# EAGLE design dac-shield (EAGLE 6.6.0)
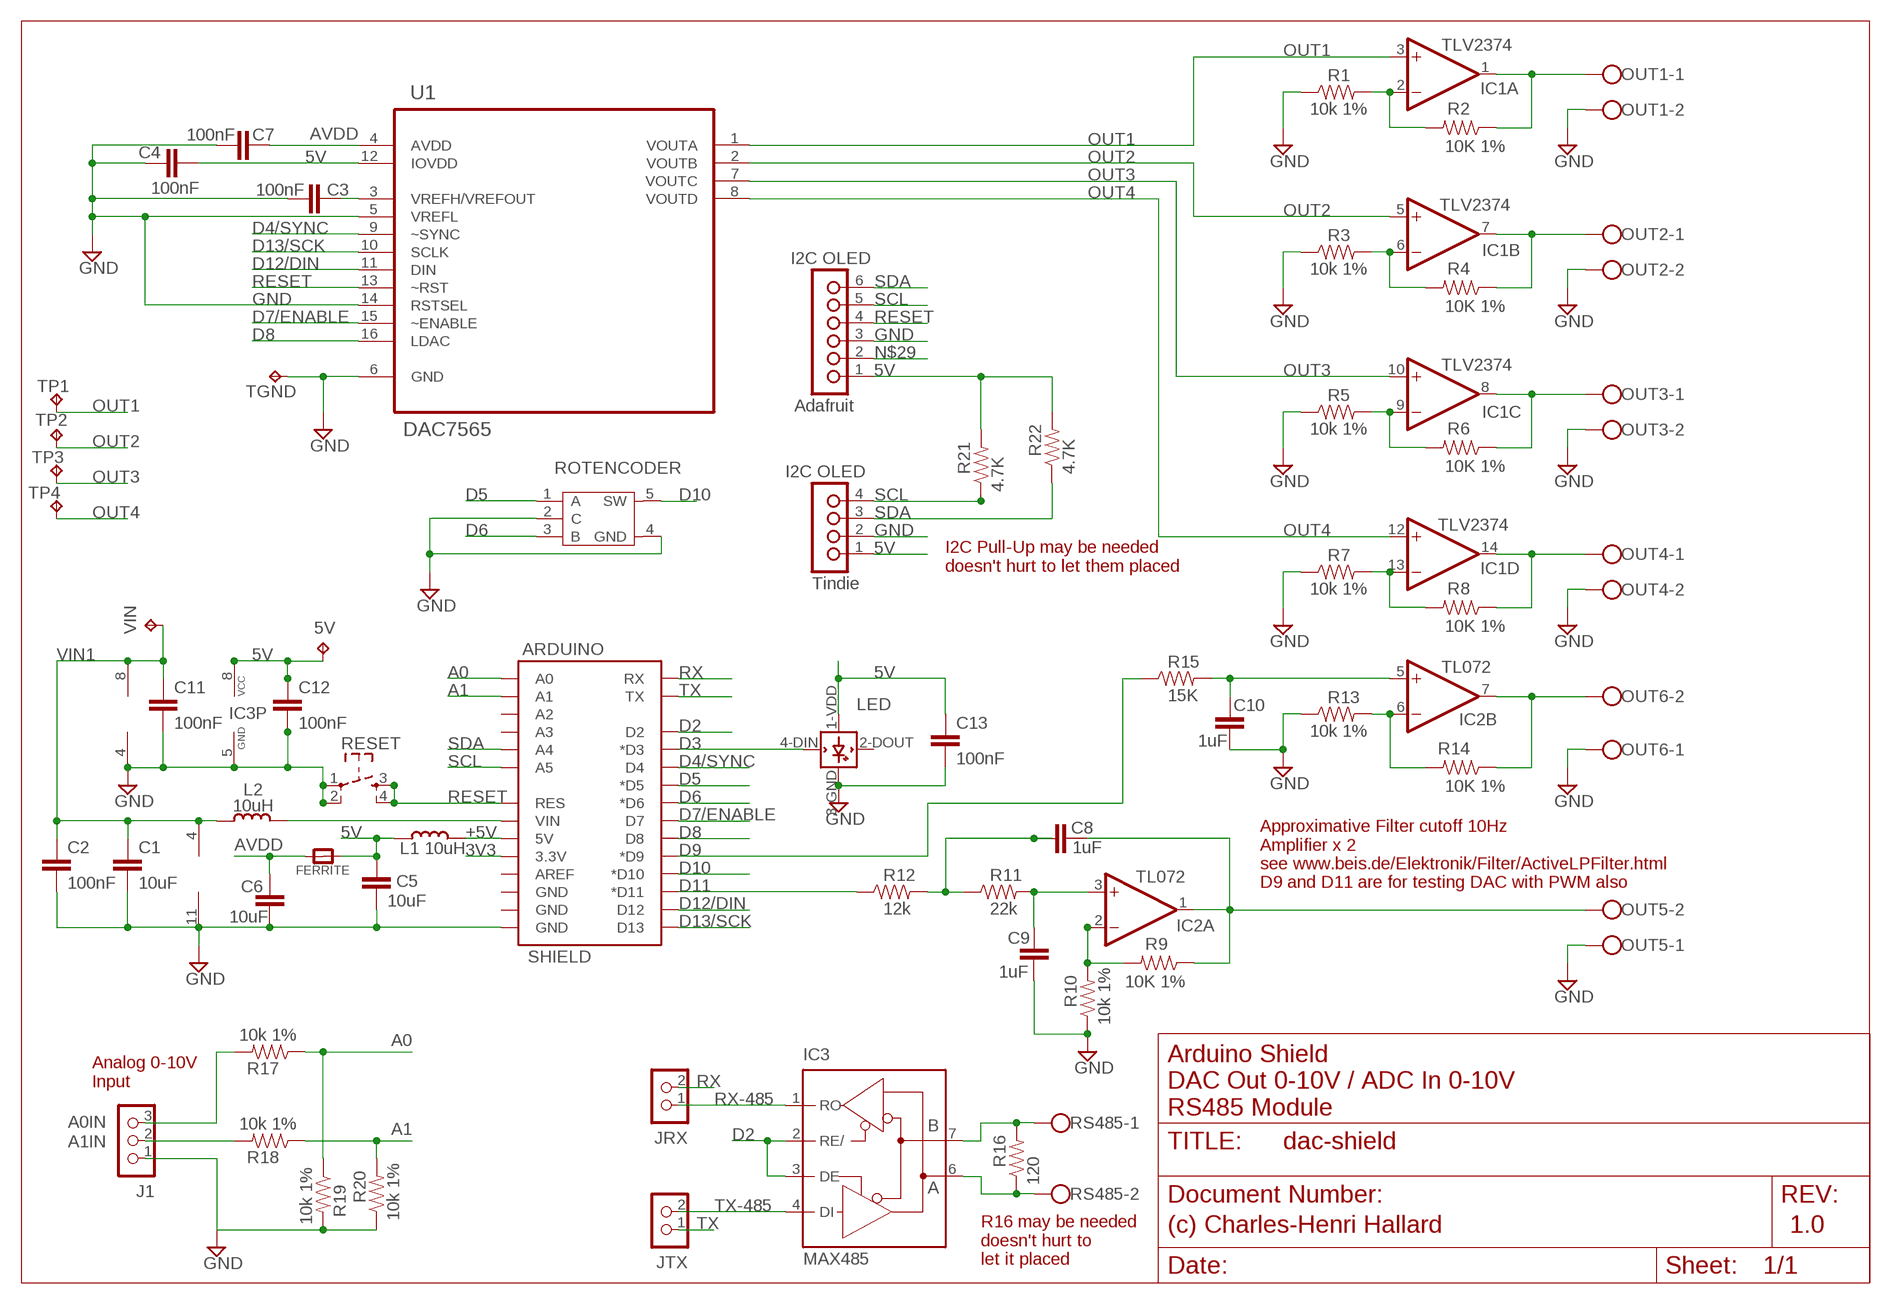
[diagram p0: schematic, sheet 1]

## Parts
5V  TPPAD1-13  [P1-13]
ARDUINO  SHIELD  ARDUINO_SHIELDNOHOLES  [DUEMILANOVE_SHIELD_NOHOLES]
C1  10uF  CAP0805-CAP  [0805-CAP]
C2  100nF  CAP0805-CAP  [0805-CAP]
C3  100nF  CAP0805-CAP  [0805-CAP]
C4  100nF  CAP0805-CAP  [0805-CAP]
C5  10uF  CAP0805-CAP  [0805-CAP]
C6  10uF  CAP0805-CAP  [0805-CAP]
C7  100nF  CAP0805-CAP  [0805-CAP]
C8  1uF  CAP0805-CAP  [0805-CAP]
C9  1uF  CAP0805-CAP  [0805-CAP]
C10  1uF  CAP0805-CAP  [0805-CAP]
C11  100nF  CAP0805-CAP  [0805-CAP]
C12  100nF  CAP0805-CAP  [0805-CAP]
C13  100nF  CAP0805-CAP  [0805-CAP]
FERRITE  FERRITE_0603  [_0603]
IC1  TLV2374  LM324D  [SO14]
IC2  TL072  TL072D  [SO08]
IC3  MAX485  MAX481CSA  [SO08]
J1  CON_HEADER_1X03-PTH  [M1X3]
JRX  CON_HEADER_1X02-PTH  [M1X2]
JTX  CON_HEADER_1X02-PTH  [M1X2]
L1  10uH  INDUCTOR_0805  [_0805]
L2  10uH  INDUCTOR_0805  [_0805]
LED  WS2812B  [WS2812B]
OUT1  CON-CLAMP-2  [W237-102]
OUT2  CON-CLAMP-2  [W237-102]
OUT3  CON-CLAMP-2  [W237-102]
OUT4  CON-CLAMP-2  [W237-102]
OUT5  CON-CLAMP-2  [W237-102]
OUT6  CON-CLAMP-2  [W237-102]
R1  10k 1%  RESISTOR0805-RES  [0805-RES]
R2  10K 1%  RESISTOR0805-RES  [0805-RES]
R3  10k 1%  RESISTOR0805-RES  [0805-RES]
R4  10K 1%  RESISTOR0805-RES  [0805-RES]
R5  10k 1%  RESISTOR0805-RES  [0805-RES]
R6  10K 1%  RESISTOR0805-RES  [0805-RES]
R7  10k 1%  RESISTOR0805-RES  [0805-RES]
R8  10K 1%  RESISTOR0805-RES  [0805-RES]
R9  10K 1%  RESISTOR0805-RES  [0805-RES]
R10  10k 1%  RESISTOR0805-RES  [0805-RES]
R11  22k  RESISTOR0805-RES  [0805-RES]
R12  12k  RESISTOR0805-RES  [0805-RES]
R13  10k 1%  RESISTOR0805-RES  [0805-RES]
R14  10K 1%  RESISTOR0805-RES  [0805-RES]
R15  15K  RESISTOR0805-RES  [0805-RES]
R16  120  RESISTOR0805-RES  [0805-RES]
R17  10k 1%  RESISTOR0805-RES  [0805-RES]
R18  10k 1%  RESISTOR0805-RES  [0805-RES]
R19  10k 1%  RESISTOR0805-RES  [0805-RES]
R20  10k 1%  RESISTOR0805-RES  [0805-RES]
R21  4.7K  RESISTOR0805-RES  [0805-RES]
R22  4.7K  RESISTOR0805-RES  [0805-RES]
RESET  SW_TACT_4P  [SW_TACT_SMALL]
ROTENCODER  ROTARY-ENCODE-5P  [5P-13.75X11.7X6.5H]
RS485  CON-CLAMP-2  [W237-102]
TGND  TPPAD1-13  [P1-13]
TP1  TPPAD1-13  [P1-13]
TP2  TPPAD1-13  [P1-13]
TP3  TPPAD1-13  [P1-13]
TP4  TPPAD1-13  [P1-13]
U1  DAC7565  DAC7565IAPW  [SOP65P640X120-16N]
U$1  OLED_I2C_ADAFRUIT  [1X06_LOCK]
U$2  OLED_I2C_TINDIE  [1X04_LOCK]
VIN  TPPAD1-13  [P1-13]

## Nets
3V3: ARDUINO.3.3V
5V: 5V.TP C4.1 C5.1 C12.1 C13.1 FERRITE.1 IC3.8(VCC) L1.1 LED.1-VDD(VDD) R21.2 R22.2 U1.12(IOVDD) U$1.1(VIN) U$2.1(VCC)
+5V: ARDUINO.5V L1.2
A0: ARDUINO.A0 R17.1 R19.1
A0IN: J1.3 R17.2
A1: ARDUINO.A1 R18.1 R20.2
A1IN: J1.2 R18.2
AVDD: C6.2 C7.1 FERRITE.2 U1.4(AVDD)
D2: ARDUINO.D2 IC3.2(RE/) IC3.3(DE)
D3: ARDUINO.D3(*D3) LED.4-DIN(DIN)
D4/SYNC: ARDUINO.D4 U1.9(~SYNC)
D5: ARDUINO.D5(*D5) ROTENCODER.1(A)
D6: ARDUINO.D6(*D6) ROTENCODER.3(B)
D7/ENABLE: ARDUINO.D7 U1.15(~ENABLE)
D8: ARDUINO.D8 U1.16(LDAC)
D9: ARDUINO.D9(*D9) R15.1
D10: ARDUINO.D10(*D10) ROTENCODER.5(SW)
D11: ARDUINO.D11(*D11) R12.1
D12/DIN: ARDUINO.D12 U1.11(DIN)
D13/SCK: ARDUINO.D13 U1.10(SCLK)
GND: ARDUINO.GND@0(GND) C1.2 C2.2 C3.2 C4.2 C5.2 C6.1 C7.2 C9.1 C10.1 C11.2 C12.2 C13.2 IC1.11(P:V-) IC2.4(P:V-) IC3.5(GND) J1.1 LED.3-GND(GND) OUT1.2 OUT2.2 OUT3.2 OUT4.2 OUT5.1 OUT6.1 R1.1 R3.1 R5.1 R7.1 R10.1 R13.1 R19.2 R20.1 RESET.1 RESET.2 ROTENCODER.2(C) ROTENCODER.4(GND) TGND.TP U1.5(VREFL) U1.6(GND) U1.14(RSTSEL) U$1.3(GND) U$2.2(GND)
N$1: IC1.6(B:-IN) R3.2 R4.2
N$2: IC1.2(A:-IN) R1.2 R2.2
N$3: IC1.1(A:OUT) OUT1.1 R2.1
N$4: ARDUINO.VIN L2.2
N$5: IC2.2(A:-IN) R9.2 R10.2
N$6: C3.1 U1.3(VREFH/VREFOUT)
N$7: IC2.6(B:-IN) R13.2 R14.2
N$8: C8.2 IC2.1(A:OUT) OUT5.2 R9.1
N$9: IC1.7(B:OUT) OUT2.1 R4.1
N$10: IC1.9(C:-IN) R5.2 R6.2
N$11: IC1.8(C:OUT) OUT3.1 R6.1
N$12: IC1.13(D:-IN) R7.2 R8.2
N$13: IC1.14(D:OUT) OUT4.1 R8.1
N$14: C8.1 R11.1 R12.2
N$16: C9.2 IC2.3(A:+IN) R11.2
N$18: IC2.7(B:OUT) OUT6.2 R14.1
N$19: C10.2 IC2.5(B:+IN) R15.2
N$24: IC3.7(B) R16.2 RS485.1
N$25: IC3.6(A) R16.1 RS485.2
N$29: U$1.2(3V3)
OUT1: IC1.3(A:+IN) TP1.TP U1.1(VOUTA)
OUT2: IC1.5(B:+IN) TP2.TP U1.2(VOUTB)
OUT3: IC1.10(C:+IN) TP3.TP U1.7(VOUTC)
OUT4: IC1.12(D:+IN) TP4.TP U1.8(VOUTD)
RESET: ARDUINO.RES RESET.3 RESET.4 U1.13(~RST) U$1.4(RST)
RX: ARDUINO.RX JRX.2
RX-485: IC3.1(RO) JRX.1
SCL: ARDUINO.A5 R21.1 U$1.5(SCL) U$2.4(SCL)
SDA: ARDUINO.A4 R22.1 U$1.6(SDA) U$2.3(SDA)
TX: ARDUINO.TX JTX.1
TX-485: IC3.4(DI) JTX.2
VIN1: C1.1 C2.1 C11.1 IC1.4(P:V+) IC2.8(P:V+) L2.1 VIN.TP
Unconnected: ARDUINO.A2 ARDUINO.A3 ARDUINO.AREF ARDUINO.GND@1(GND) ARDUINO.GND@2(GND) LED.2-DOUT(DOUT)

## Notes on the sheet
- I2C Pull-Up may be needed
  doesn't hurt to let them placed
- Approximative Filter cutoff 10Hz 
  Amplifier x 2
  see www.beis.de/Elektronik/Filter/ActiveLPFilter.html
  D9 and D11 are for testing DAC with PWM also
- Analog 0-10V
  Input
- Arduino Shield
  DAC Out 0-10V / ADC In 0-10V
  RS485 Module
- (c) Charles-Henri Hallard | 1.0
- R16 may be needed
  doesn't hurt to
  let it placed

## Library data of the parts
5V TGND TP1-TP4 VIN = testpad:TP: Test pad
ARDUINO = SparkFun-Boards:ARDUINO_SHIELD: Arduino shield footprint
C1-C13 = LowPowerLab:CAP: Capacitor Standard 0603 ceramic capacitor, and 0.1" leaded capacitor.
FERRITE = microbuilder:FERRITE: Ferrite Bead 0603 MMZ1608B121C - 120 Ohm @ 100MHz, 600mA, 0.15 Ohm DC Resistance - Digikey: 445-2164-1-ND BK1608HW121-T - 120 Ohm, 600mA Ferrite Chip - Digikey: 587-1876-2-ND 0805 HZ0805B272R-10 - 2.7K Ohm @ 100MHz, 200mA, 0.8 Ohm DC Resistance - Digikey: 240-2504-1-ND (see also Murata BLM21BD272SN1L) MMZ2012Y152B - 1.5K Ohm @ 100MHz, 500mA, 0.4 Ohm DC Resistance - Digikey: 445-1560-1-ND - Mainly for high frequency (80-400MHz) MMZ2012R102A - 1K Ohm @ 100MHz, 500mA, 0.3 Ohm DC Resistance - Digikey: 445-1555-2-ND - More general purpose (10-200MHz)
IC1 = linear:LM324: OP AMP
IC2 = linear:TL072: OP AMP
IC3 = maxim:MAX481CSA: RS485 TRANSEIVER; MF: MAXIM; MPN: MAX481CSA; OC_FARNELL: unknown; OC_NEWARK: 90C3817
J1 = dp_devices:CON_HEADER_1X03
JRX JTX = dp_devices:CON_HEADER_1X02
L1 L2 = microbuilder:INDUCTOR: Inductors 0603: 10nH Ceramic Inductor - microwire antenna/RF (Digikey: 712-1434-2-ND) 0805: 560nH Ceramic Inductor - RF (Digikey: 553-1047-1-ND) 270nH Ceramic Inductor - Q = 40@250MHz, +-5%, 1 Ohm DC Resistance (Digikey: 535-10506-2-ND) 1007 (2518 Metric) SMT: 10µH 10% 250mOhm 820mA 1007 Inductor (Digikey: 587-2189-1-ND) 22µH 10% 500mOhm 580mA 1007 Inductor (Digikey: 587-2190-1-ND) 47µH 10% 950mOhm 420mA 1007 Inductor (Digikey: 587-2191-1-ND) 47µH 5% 100mOhm 1A 1008 Inductor (Digikey: 732-1816-1-ND) 5.0x5.0mm (Taiyo Yuden NR5040 Series) 6.8µH 20% 2.3A 64mOhm Inductor (Digikey: 587-2374-2-ND) 5.0x5.0mm (TDK VLC5045 Series) 4.7µH 20% 3.3A 34mOhm Inductor (Digikey: 445-6526-1-ND) 6.8µH 20% 2.7A 46mOhm Inductor (Digikey: 445-6527-1-ND) 6.0x6.0mm (TDK VLC6045 Series) 4.7µH 20% 3.8A 27mOhm Inductor (Digikey: 445-6538-2-ND) 6.8µH 20% 3A 41mOhm Inductor (Digikey: 445-6540-1-ND) 6.2µH 30% 2.2A 45mOhm Inductor (Digikey: SRR5028-6R2YCT-ND) - Not TDK VLC6045 but footprint should match 6.0x6.0mm (TDK SLF6045 Series) 6.8uH 30% 2A 33mOhm Inductor (Digikey: 445-4572-1-ND, Mouser: 810-SLF645T6R8N2R0PF)
LED = adafruit:WS2812B
OUT1-OUT6 RS485 = _c2h:CON-CLAMP-2: WAGO SCREW CLAMP
R1-R22 = LowPowerLab:RESISTOR: Resistor Basic schematic elements and footprints for 0603, 1206, and PTH resistors.
RESET = dp_devices:SW_TACT_4P
ROTENCODER = Seeed-Discrete:ROTARY-ENCODE-5P: Rotary Encode With Switch http://www.seeedstudio.com/depot/rotary-encoder-with-switch-p-667.html?cPath=156_160
U1 = Texas Instruments_By_element14_Batch_1:DAC7565IAPW: DAC; MPN: DAC7565IAPW; OC_FARNELL: 1604982; OC_NEWARK: 94M6804; PACKAGE: TSSOP-16; SUPPLIER: Texas Instruments
U$1 = _c2h:OLED_I2C_ADAFRUIT
U$2 = _c2h:OLED_I2C_TINDIE

## Board
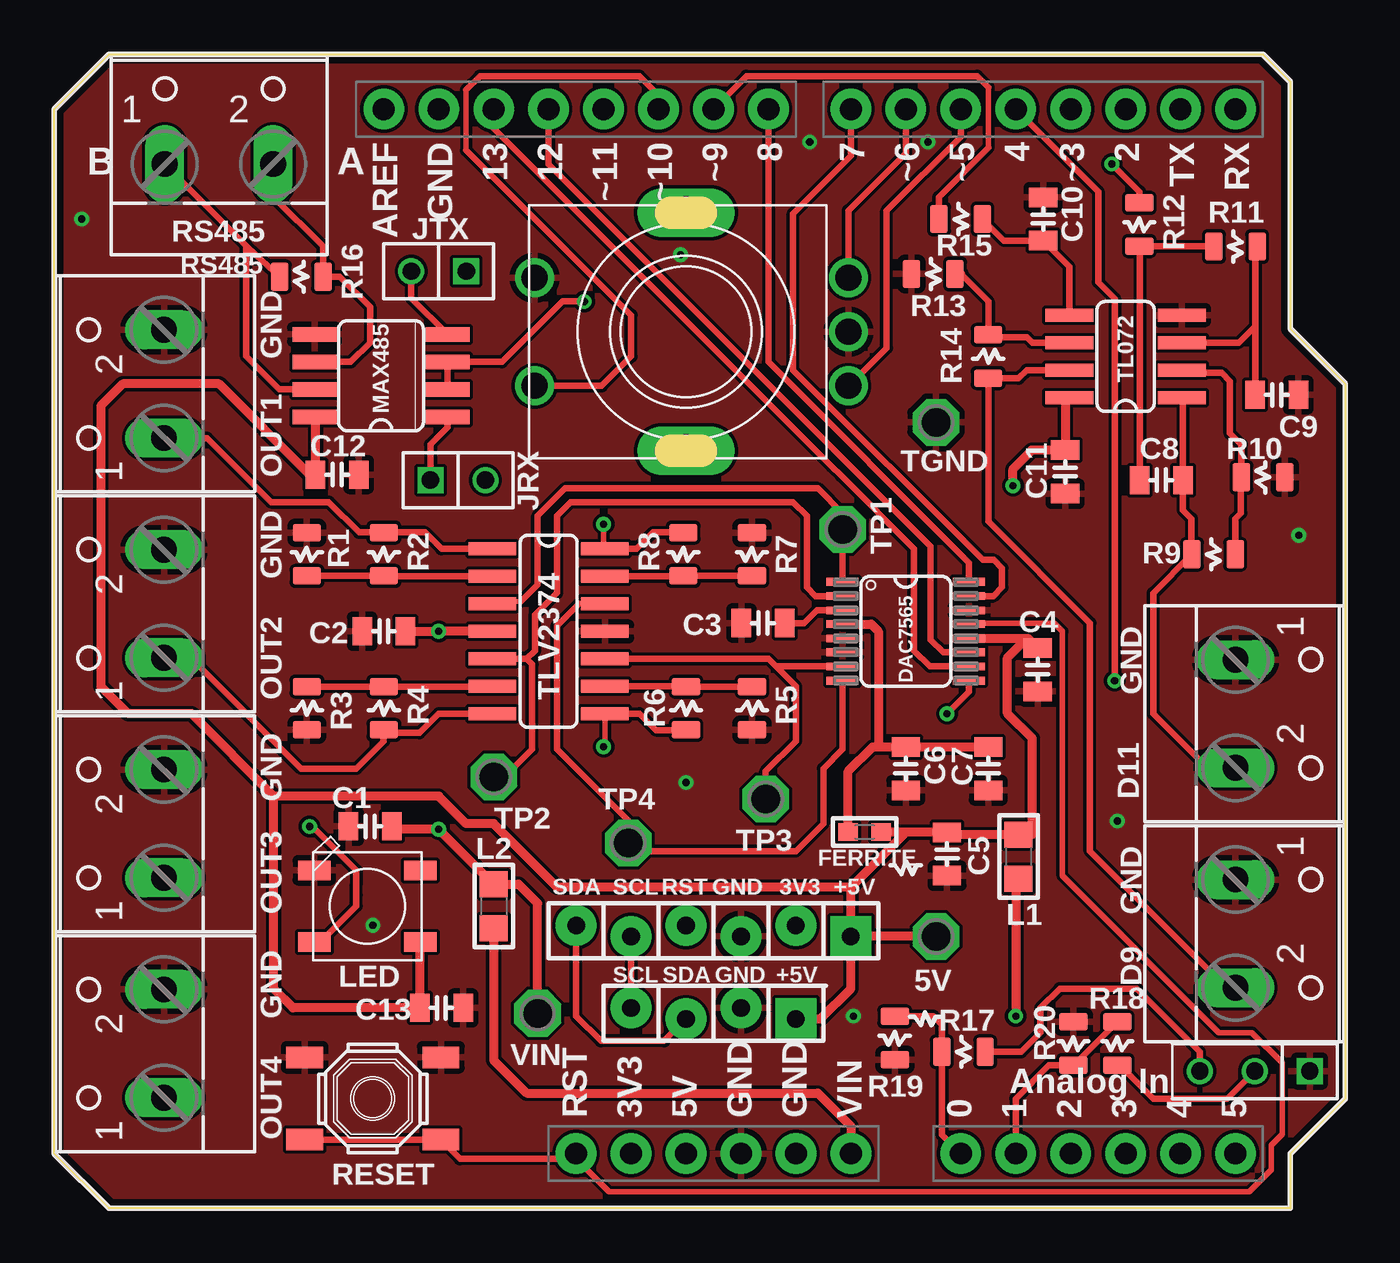
[diagram p1: board, top side]
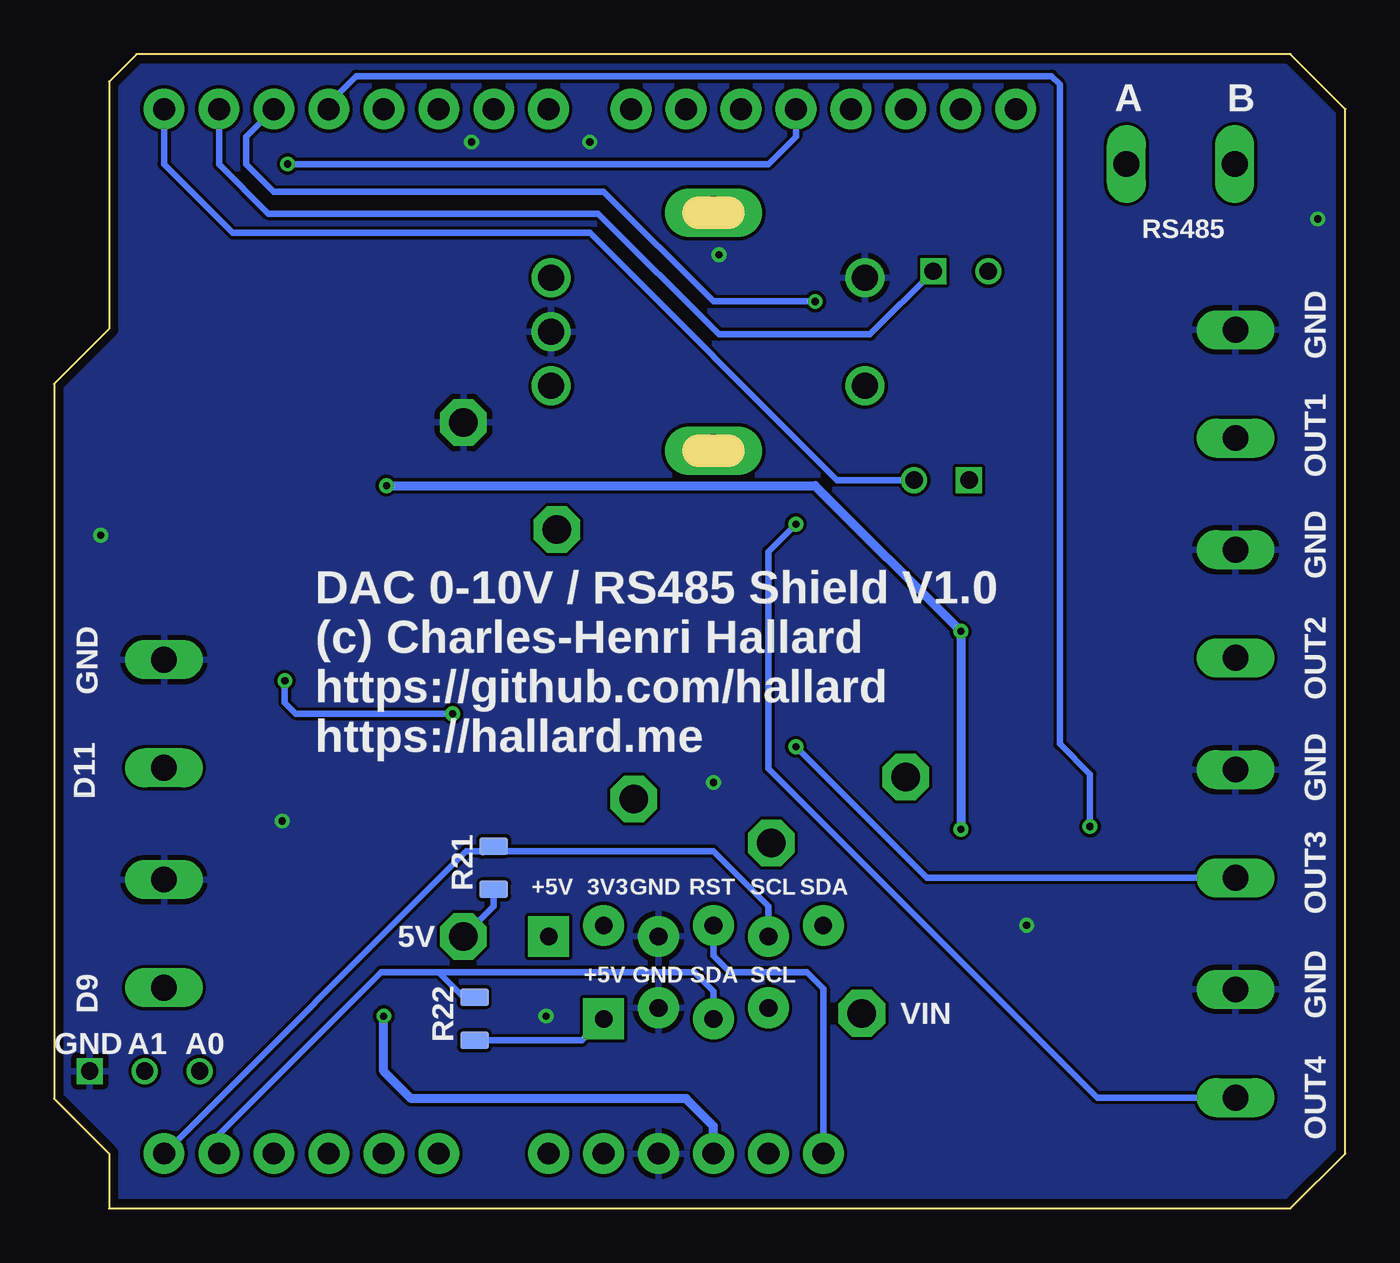
[diagram p2: board, bottom side, seen from below]

Size 59.69 x 53.34 mm. Coordinates in mm from the lower left corner, seen from the top.
Outline: 0,50.8 2.54,53.34 55.88,53.34 57.15,52.07 57.15,40.64 59.69,38.1 59.69,5.08 57.15,2.54 57.15,0 2.54,0 0,2.54 0,50.8
Copper layers (1*16): Top 0.0356mm / dielectric 1.5011mm / Bottom 0.0356mm
Design rules "oshpark *": minimum track width 6mil, minimum drill 13mil, track to track 6mil, track to pad 6mil, pad to pad 6mil, via to via 6mil, smd to smd 6mil, copper to edge 15mil, drill to drill 6mil, minimum pad ring 7mil, minimum via ring 7mil, stop-mask expansion 3mil, vias tented up to drill 40mil, thermal gap 10mil

### Footprints (pad centres in the part's own frame; a part is rotated, then mirrored left to right if it is on the bottom)
P1-13 = drill 1.321 pad 2.159 octagon: TP 0,0
DUEMILANOVE_SHIELD_NOHOLES = drill 1.016 pad 1.88: 3.3V 50.8,26.67; 5V 50.8,29.21; A0 50.8,41.91; A1 50.8,44.45; A2 50.8,46.99; A3 50.8,49.53; A4 50.8,52.07; A5 50.8,54.61; AREF 2.54,15.24; D2 2.54,49.53; D3 2.54,46.99; D4 2.54,44.45; D5 2.54,41.91; D6 2.54,39.37; D7 2.54,36.83; D8 2.54,33.02; D9 2.54,30.48; D10 2.54,27.94; D11 2.54,25.4; D12 2.54,22.86; D13 2.54,20.32; GND@0 50.8,31.75; GND@1 50.8,34.29; GND@2 2.54,17.78; RES 50.8,24.13; RX 2.54,54.61; TX 2.54,52.07; VIN 50.8,36.83
0805-CAP = smd 0.902 x 1.3: 1 -1,0; 2 1,0
_0603 = smd 0.9 x 0.8: 1 -0.762,0; 2 0.762,0
SO14 = smd 0.6 x 2.2: 1 -3.81,-2.6; 2 -2.54,-2.6; 3 -1.27,-2.6; 4 0,-2.6; 5 1.27,-2.6; 6 2.54,-2.6; 7 3.81,-2.6; 8 3.81,2.6; 9 2.54,2.6; 10 1.27,2.6; 11 0,2.6; 12 -1.27,2.6; 13 -2.54,2.6; 14 -3.81,2.6
SO08 = smd 0.6 x 2.2: 1 -1.905,-2.6; 2 -0.635,-2.6; 3 0.635,-2.6; 4 1.905,-2.6; 5 1.905,2.6; 6 0.635,2.6; 7 -0.635,2.6; 8 -1.905,2.6
SO08' = smd 0.66 x 2.032: 1 -1.905,-3.073; 2 -0.635,-3.073; 3 0.635,-3.073; 4 1.905,-3.073; 5 1.905,3.073; 6 0.635,3.073; 7 -0.635,3.073; 8 -1.905,3.073
M1X3 = drill 0.8 square: 1 0,0 | drill 0.8: 2 2.54,0; 3 5.08,0
M1X2 = drill 0.8 square: 1 -1.27,0 | drill 0.8: 2 1.27,0
_0805 = smd 1.2 x 1.3: 1 -1.016,0; 2 1.016,0
WS2812B = smd 1.5 x 0.9: 1-VDD 2.45,-1.65; 2-DOUT 2.45,1.65; 3-GND -2.45,1.65; 4-DIN -2.45,-1.65
W237-102 = drill 1.194 long: 1 -2.5,-1.27; 2 2.5,-1.27
0805-RES = smd 0.8 x 1.3: 1 -1,0; 2 1,0
SW_TACT_SMALL = smd 1.7 x 1: 1 -3.15,1.9; 2 3.15,1.9; 3 -3.15,-1.9; 4 3.15,-1.9
5P-13.75X11.7X6.5H = drill 1.2 pad 1.8: 1 -2.5,-7.5; 2 0,-7.5; 3 2.5,-7.5; 4 2.5,7; 5 -2.5,7 | drill 1.5 pad 2 long: P1 -5.5,0; P2 5.5,0
SOP65P640X120-16N = smd 1.473 x 0.356: 1 -2.921,2.286; 2 -2.921,1.626; 3 -2.921,0.965; 4 -2.921,0.33; 5 -2.921,-0.33; 6 -2.921,-0.965; 7 -2.921,-1.626; 8 -2.921,-2.286; 9 2.921,-2.286; 10 2.921,-1.626; 11 2.921,-0.965; 12 2.921,-0.33; 13 2.921,0.33; 14 2.921,0.965; 15 2.921,1.626; 16 2.921,2.286
1X06_LOCK = drill 0.813 pad 1.88 square: 1 0,0.127 | drill 0.813 pad 1.88: 2 2.54,-0.381; 3 5.08,0.127; 4 7.62,-0.381; 5 10.16,0.127; 6 12.7,-0.381
1X04_LOCK = drill 0.813 pad 1.88 square: 1 1.27,1.397 | drill 0.813 pad 1.88: 2 3.81,0.889; 3 6.35,1.397; 4 8.89,0.889

### Placement (x,y rotation side)
5V  40.77,12.57 0 top
ARDUINO  0,53.34 270 top
C1  14.61,17.65 180 top
C2  15.24,26.67 180 top
C3  32.77,27.05 180 top
C4  45.47,24.89 270 top
C5  41.27,16.38 270 top
C6  39.37,20.32 90 top
C7  43.18,20.32 270 top
C8  51.18,33.66 0 top
C9  56.52,37.59 180 top
C10  45.72,45.72 270 top
C11  46.74,34.04 270 top
C12  13.08,33.91 0 top
C13  17.91,9.27 0 top
FERRITE  37.47,17.4 180 top
IC1  22.86,26.67 270 top
IC2  49.53,39.37 90 top
IC3  MAX485  [SO08']  15.11,38.48 90 top
J1  58.04,6.35 180 top
JRX  18.67,33.66 0 top
JTX  17.78,43.31 180 top
L1  44.58,16.26 270 top
L2  20.32,13.97 270 top
LED  14.48,13.97 0 top
OUT1  3.81,38.1 90 top
OUT2  3.81,27.94 90 top
OUT3  3.81,17.78 90 top
OUT4  3.81,7.62 90 top
OUT5  55.88,22.86 270 top
OUT6  55.88,12.7 270 top
R1  11.68,30.23 270 top
R2  15.24,30.23 270 top
R3  11.68,23.11 90 top
R4  15.24,23.11 90 top
R5  32.26,23.11 90 top
R6  29.21,23.11 90 top
R7  32.26,30.23 270 top
R8  29.08,30.23 270 top
R9  53.59,30.23 0 top
R10  55.88,33.78 180 top
R11  54.61,44.45 0 top
R12  50.16,45.47 270 top
R13  40.64,43.18 0 top
R14  43.18,39.37 90 top
R15  41.91,45.72 0 top
R16  11.43,43.05 180 top
R17  42.04,7.24 0 top
R18  49.15,7.62 270 top
R19  38.86,7.87 270 top
R20  47.12,7.62 270 top
R21  39.37,15.75 270 bottom
R22  40.26,8.76 270 bottom
RESET  14.73,5.08 0 top
ROTENCODER  29.21,40.51 90 top
RS485  7.62,49.53 0 top
TGND  40.77,36.32 0 top
TP1  36.45,31.37 0 top
TP2  20.32,19.94 0 top
TP3  32.89,18.92 0 top
TP4  26.54,16.89 0 top
U1  39.37,26.67 0 top
U$1  36.83,12.7 180 top
U$2  35.56,10.16 180 top
VIN  22.35,9.02 0 top

### Tracks (layer width: path | path; a pad name or v marks a point on that pad's centre or on a via)
5V
  Top 0.305: FERRITE.1 38.21,17.38
  Top 0.406: 39.37,17.38 C5.1 41.39,17.27 L1.1 45.21,17.27 45.21,21.72 44.07,22.86 44.07,25.45 44.96,26.34 | 39.37,17.38 38.21,17.38 | U1.12 44.96,26.34 | 44.96,26.34 45.02,26.34 C4.1 | U$1.1 36.83,14.84 | 36.83,14.84 39.37,17.38 | 5V.TP U$1.1 | IC3.8 12.08,36.53 C12.1 11.81,33.91 7.62,38.1 3.17,38.1 2.16,37.08 2.16,24.13 3.43,22.86 6.35,22.86 10.16,19.05 | 36.83,14.84 23.26,14.84 20.32,17.78 19.05,17.78 17.78,19.05 10.16,19.05 | 10.16,19.05 10.16,10.16 11.05,9.27 C13.1 16.91,12.3 LED.1-VDD | U$2.1 35.43,8.76 36.83,10.16 U$1.1
  Bottom 0.305: R22.2 35.29,7.76 U$2.1 | R21.2 39.37,13.97 5V.TP
+5V  (via drill 0.33 pad 0.64)
  Top 0.406: L1.2 44.45,15.11 v44.45,8.89
  Bottom 0.406: ARDUINO.5V 29.21,3.81 30.48,5.08 43.18,5.08 44.45,6.35 v44.45,8.89
A0
  Top 0.305: R19.1 38.88,8.89 40.64,8.89 41.04,8.49 R17.1 41.04,3.41 ARDUINO.A0
A0IN
  Top 0.305: J1.3 52.96,7.24 50.04,10.16 46.48,10.16 45.59,9.27 45.59,8.13 44.7,7.24 R17.2
A1
  Top 0.305: ARDUINO.A1 44.45,5.08 45.99,6.62 R20.2 47.15,6.62 R18.1
A1IN
  Top 0.305: J1.2 54.23,5.08 50.8,5.08 49.26,6.62 R18.2
AVDD
  Top 0.406: C7.1 C6.2 38.1,21.32 | 38.1,21.32 37.83,21.32 36.7,20.19 FERRITE.2 | U1.4 37.77,27 38.1,26.67 38.1,21.32
D2  (via drill 0.33 pad 0.64)
  Top 0.305: IC3.2 IC3.3 20.7,39.12 23.5,41.91 v24.51,41.91
  Bottom 0.305: ARDUINO.D2 50.8,49.53 50.8,48.26 49.53,46.99 34.29,46.99 29.21,41.91 v24.51,41.91
D3  (via drill 0.33 pad 0.64)
  Top 0.305: LED.4-DIN 12.03,12.03 13.97,13.97 13.97,14.48 13.97,14.99 13.97,15.62 11.94,17.65 v11.81,17.65
  Bottom 0.305: ARDUINO.D3 46.99,51.05 45.72,52.32 13.59,52.32 13.21,51.94 13.21,21.46 11.81,20.07 v11.81,17.65
D4/SYNC  (via drill 0.33 pad 0.64)
  Top 0.305: ARDUINO.D4 48.26,46.99 48.26,42.8 49.02,42.04 v49.02,24.38 | U1.9 42.29,23.88 v41.27,22.86
  Bottom 0.305: v49.02,24.38 49.02,23.37 48.51,22.86 v41.27,22.86
D5
  Top 0.305: ROTENCODER.1 37.25,38.52 38.48,39.75 38.48,46.1 41.91,49.53 ARDUINO.D5
D6
  Top 0.305: ROTENCODER.3 36.71,46.11 39.37,48.77 ARDUINO.D6
D7/ENABLE
  Top 0.305: ARDUINO.D7 36.83,48.64 34.16,45.97 34.16,38.73 42.93,29.97 43.43,29.97 43.81,29.59 43.81,28.7 43.41,28.3 U1.15
D8
  Top 0.305: U1.16 42.29,29.84 33.02,39.12 ARDUINO.D8
D9
  Top 0.254: 43.18,51.82 43.18,49.02
  Top 0.305: ARDUINO.D9 32,52.32 42.67,52.32 43.18,51.82 | 43.18,49.02 40.89,46.74 40.89,45.74 R15.1
D10
  Top 0.254: 19.05,51.69 19.05,48.9
  Top 0.305: ARDUINO.D10 27.94,51.44 27.05,52.32 19.68,52.32 19.05,51.69 | 19.05,48.9 26.67,41.27 26.67,39.37 25.31,38.01 ROTENCODER.5
D11  (via drill 0.33 pad 0.64)
  Top 0.305: R12.1 50.16,46.99 49.85,47.31 v48.9,48.26
  Bottom 0.305: ARDUINO.D11 25.4,49.53 26.67,48.26 v48.9,48.26
D12/DIN
  Top 0.305: U1.11 41.1,25.7 40.51,26.29 40.51,30.61 22.86,48.26 ARDUINO.D12
D13/SCK
  Top 0.305: U1.10 40.49,25.04 39.75,25.78 39.75,30.48 36.39,33.85 35.94,34.29 20.32,49.91 ARDUINO.D13
GND  (via drill 0.33 pad 0.64)
  other vias: 28.96,44.07 34.92,49.28 40.39,49.28 29.21,19.68 36.96,8.89 49.15,17.91 14.73,13.08 1.27,45.72 57.53,31.11
  pour Top: 0,53.34 0,0 59.69,0 59.69,53.34
  pour Bottom: 59.69,53.34 0,53.34 0,0 59.69,0
N$1
  Top 0.254: 20.24,24.11 IC1.6
  Top 0.305: 20.24,24.11 R4.2 R3.2
N$2
  Top 0.305: IC1.2 15.26,29.21 R2.2 R1.2
N$3
  Top 0.305: IC1.1 17.91,30.48 17.14,31.24 15.26,31.24 R2.1 15.22,31.24 14.1,31.24 12.7,32.64 10.03,32.64 7.07,35.6 OUT1.1
N$4
  Top 0.406: L2.2 20.32,6.86 21.84,5.33 35.31,5.33 36.83,3.81 ARDUINO.VIN
N$5
  Top 0.305: R9.2 54.59,31.86 54.86,32.13 54.86,33.77 R10.2 54.88,35.29 54.36,35.81 54.36,38.23 53.98,38.61 53.09,38.61 52.96,38.73
  Top 0.406: IC2.2 52.96,38.73
N$6
  Top 0.305: U1.3 35.26,27.64 34.67,27.05 C3.1
N$7
  Top 0.305: IC2.6 45.21,40.01 44.96,40.26 43.29,40.26 | 41.91,43.18 43.18,41.91 R14.2
  Top 0.406: 43.29,40.26 R14.2 | R13.2 41.91,43.18
N$8
  Top 0.305: IC2.1 52.18,37.47 C8.2 52.18,32.27 52.58,31.88 52.58,30.24 R9.1 50.8,28.43 50.8,22.86 53.3,20.36 OUT5.2
N$9
  Top 0.254: 15.38,21.97 R4.1
  Top 0.305: IC1.7 17.78,22.86 16.89,21.97 15.38,21.97 | R4.1 15.24,21.59 13.97,20.32 11.43,20.32 6.31,25.44 OUT2.1
N$10
  Top 0.305: IC1.9 28.94,24.13 R6.2 R5.2
N$11  (via drill 0.33 pad 0.64)
  Top 0.254: 29.19,22.1 R6.1 | IC1.8 25.46,21.4 v25.4,21.34
  Top 0.305: IC1.8 27.05,22.86 27.81,22.1 29.19,22.1
  Bottom 0.305: v25.4,21.34 19.34,15.28 OUT3.1
N$12
  Top 0.305: IC1.13 29.07,29.21 R8.2 R7.2
N$13  (via drill 0.33 pad 0.64)
  Top 0.254: 29.07,31.24 R8.1 | v25.4,31.62 25.4,30.54 IC1.14
  Top 0.305: IC1.14 26.92,30.48 27.69,31.24 29.07,31.24
  Bottom 0.305: OUT4.1 11.47,5.12 26.67,20.32 26.67,30.35 v25.4,31.62
N$14
  Top 0.305: C8.1 50.18,44.45 R12.2 53.59,44.47 R11.1
N$16
  Top 0.305: R11.2 55.52,44.45 55.52,40.77 | 55.52,40.77 C9.2 | IC2.3 54.75,40.01 55.52,40.77
N$18
  Top 0.305: IC2.7 44.96,38.73 44.58,38.35 43.2,38.35 | R14.1 43.18,31.75 47.88,27.05 47.88,16.51 54.19,10.2 OUT6.2
  Top 0.406: 43.2,38.35 R14.1
N$19
  Top 0.305: IC2.5 46.93,43.51 C10.2 43.91,44.72 R15.2
N$24
  Top 0.305: R16.2 9.31,44.07 8.89,44.49 | 8.89,44.49 RS485.1 | IC3.7 10.41,37.85 8.89,39.37 8.89,44.49
N$25
  Top 0.305: IC3.6 13.72,39.12 14.61,40.01 14.61,41.66 13.21,43.05 R16.1 12.43,44.47 10.16,46.74 10.16,48.22 RS485.2
OUT1
  Top 0.254: IC1.3 21.59,28.07 | U1.1 36.45,31.11
  Top 0.305: 21.59,28.07 22.35,28.83 22.35,32 23.62,33.27 35.31,33.27 36.45,32.13 TP1.TP U1.1
OUT2
  Top 0.254: 34.8,28.7 34.8,31.24
  Top 0.305: IC1.5 21.84,25.4 | 21.84,25.4 22.23,25.78 22.23,27.43 23.24,28.45 23.24,32 23.88,32.64 34.16,32.64 34.8,32 34.8,28.7 35.2,28.3 U1.2 | TP2.TP 20.83,19.94 22.1,21.21 22.1,25.15 21.84,25.4
OUT3
  Top 0.305: IC1.10 33.02,25.4 33.38,25.04 | U1.7 33.38,25.04 | TP3.TP 32.89,20.19 34.29,21.59 34.29,24.13 33.38,25.04
OUT4
  Top 0.254: 24.38,20.07 23.5,20.95 | IC1.12 24.26,27.94
  Top 0.305: 24.26,27.94 23.24,26.92 23.24,21.21 23.5,20.95 26.54,17.91 TP4.TP 26.92,16.51 34.29,16.51 35.56,17.78 35.56,20.32 36.45,21.21 U1.8
RESET
  Top 0.254: 24.13,2.41 24.13,2.29 25.65,0.76 55.24,0.76 56.26,1.78 56.26,2.92 56.77,3.43 56.77,6.73 55.37,8.13 53.85,8.13 46.61,15.37 46.61,26.67 46.23,27.05 42.34,27.05 U1.13
  Top 0.305: 24.13,2.29 18.77,2.29 RESET.4 RESET.3 | 24.13,2.41 ARDUINO.RES
  Bottom 0.305: U$1.4 29.21,11.68 28.45,10.92 24.89,10.92 24.13,10.16 ARDUINO.RES
RX
  Bottom 0.305: ARDUINO.RX 54.61,48.26 51.44,45.09 34.92,45.09 23.5,33.66 JRX.2
RX-485
  Top 0.305: IC3.1 18.19,36.09 17.4,35.31 JRX.1
SCL
  Top 0.305: U$1.5 U$2.4
  Bottom 0.305: U$1.5 26.67,13.97 29.21,16.51 39.88,16.51 40.64,16.51 ARDUINO.A5
  Bottom 0.406: R21.1 39.64,16.75 39.88,16.51
SDA
  Top 0.305: U$2.3 28.19,7.75 25.27,7.75 24.13,8.89 U$1.6
  Bottom 0.305: U$2.3 29.21,10.03 30.1,10.92 41.91,10.92 | 41.91,10.92 44.58,10.92 52.07,3.43 ARDUINO.A4 | R22.1 40.75,9.76 41.91,10.92
TX
  Bottom 0.305: ARDUINO.TX 52.07,48.26 49.78,45.97 34.54,45.97 28.96,40.39 21.97,40.39 JTX.1
TX-485
  Top 0.305: JTX.2 16.51,42.06 IC3.4
VIN1  (via drill 0.33 pad 0.64)
  Top 0.254: 16.51,26.67 C2.1
  Top 0.305: 15.73,17.53 C1.1
  Top 0.406: IC2.8 46.74,37.47 | 46.74,37.47 46.35,37.47 | 46.74,37.47 C11.1 45.2,35.04 44.32,34.16 v44.32,33.4 | IC1.4 v17.78,26.67 16.51,26.67 | VIN.TP 22.35,14.1 21.46,14.99 L2.1 v17.78,17.53 15.73,17.53
  Bottom 0.406: v17.78,17.53 v17.78,26.67 24.51,33.4 v44.32,33.4

### Text on the board
tNames: B | A | RS485 | GND | OUT1 | GND | GND | OUT2 | GND | D11 | GND | SDA | SCL | RST | GND | 3V3 | +5V | OUT3 | SCL | SDA | GND | +5V | D9 | GND | OUT4
bNames: B | A | RS485 | GND | OUT1 | GND | GND | OUT2 | DAC 0-10V / RS485 Shield V1.0 / (c) Charles-Henri Hallard / https://github.com/hallard / https://hallard.me | GND | D11 | SDA | SCL | RST | GND | 3V3 | +5V | OUT3 | 5V | SCL | SDA | GND | +5V | GND | VIN | D9 | A0 | A1 | GND | OUT4